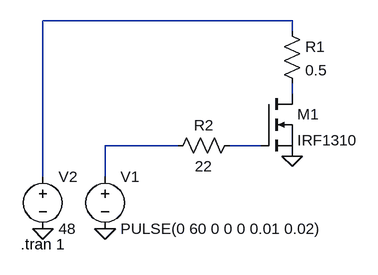
[diagram p0: schematic Draft14.asc]
Draft14.asc, the LTspice schematic file:
Version 4
SHEET 1 880 680
WIRE 320 -96 -64 -96
WIRE 320 -80 320 -96
WIRE 320 16 320 0
WIRE 144 96 32 96
WIRE 272 96 224 96
WIRE -64 144 -64 -96
WIRE 32 144 32 96
FLAG 32 224 0
FLAG -64 224 0
FLAG 320 112 0
SYMBOL voltage 32 128 R0
WINDOW 123 0 0 Left 2
WINDOW 39 0 0 Left 2
SYMATTR InstName V1
SYMATTR Value PULSE(0 60 0 0 0 0.01 0.02)
SYMBOL voltage -64 128 R0
WINDOW 123 0 0 Left 2
WINDOW 39 0 0 Left 2
SYMATTR InstName V2
SYMATTR Value 48
SYMBOL nmos 272 16 R0
SYMATTR InstName M1
SYMATTR Value IRF1310
SYMBOL res 304 -96 R0
SYMATTR InstName R1
SYMATTR Value 0.5
SYMBOL res 240 80 R90
WINDOW 0 0 56 VBottom 2
WINDOW 3 32 56 VTop 2
SYMATTR InstName R2
SYMATTR Value 22
TEXT -98 248 Left 2 !.tran 1

The netlist it stands for:
* Draft14.asc
V1 N003 0 PULSE(0 60 0 0 0 0.01 0.02)
V2 N001 0 48
M1 N002 N004 0 0 IRF1310
R1 N001 N002 0.5
R2 N004 N003 22
.model NMOS NMOS
.model PMOS PMOS
.lib standard.mos
.tran 1
.backanno
.end